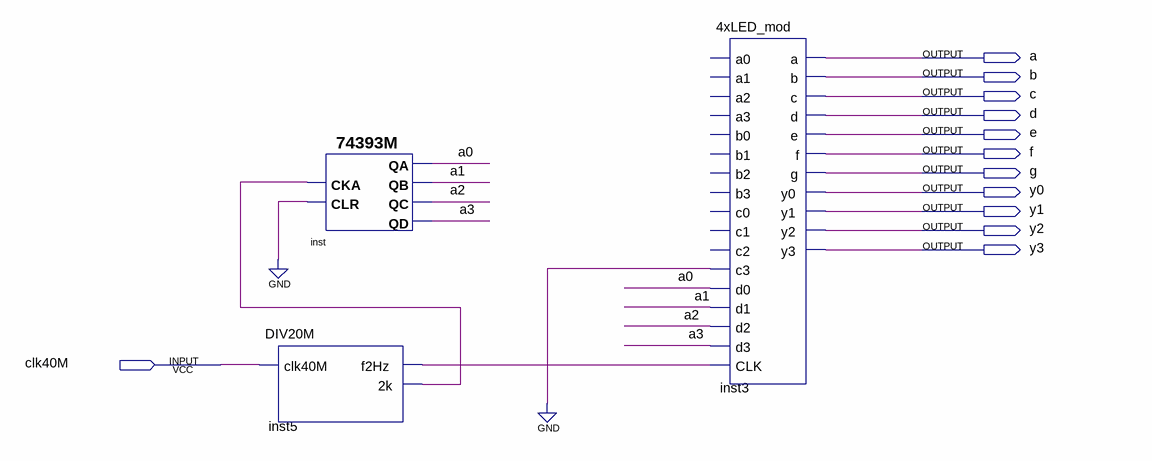
[diagram p0: schematic sheet]
// Quartus schematic 4xLED.bdf as structural Verilog: 3 symbols, 12 pins
module \4xLED  (
  input  clk40M,
  output a,
  output b,
  output c,
  output d,
  output e,
  output f,
  output g,
  output y0,
  output y1,
  output y2,
  output y3
);

  wire a0, a1, a2, a3, inst5_2k, inst5_f2hz;

  \74393M  inst (.CLR(1'b0), .CKA(inst5_2k), .QC(a2), .QD(a3), .QB(a1), .QA(a0));
  DIV20M inst5 (.clk40M(clk40M), .f2Hz(inst5_f2hz), .\2k (inst5_2k));
  \4xLED_mod  inst3 (
    .c3(1'b0), .d0(a0), .d1(a1), .d2(a2), .d3(a3), .CLK(inst5_f2hz), .a(a), .b(b), .c(c), .d(d), .e(e),
    .f(f), .g(g), .y0(y0), .y1(y1), .y2(y2), .y3(y3));  // open: a0, a1, a2, a3, b0, b1, b2, b3, c0, c1, c2
endmodule
